# EAGLE schematic esquematico_trampa (EAGLE 9.6.2)
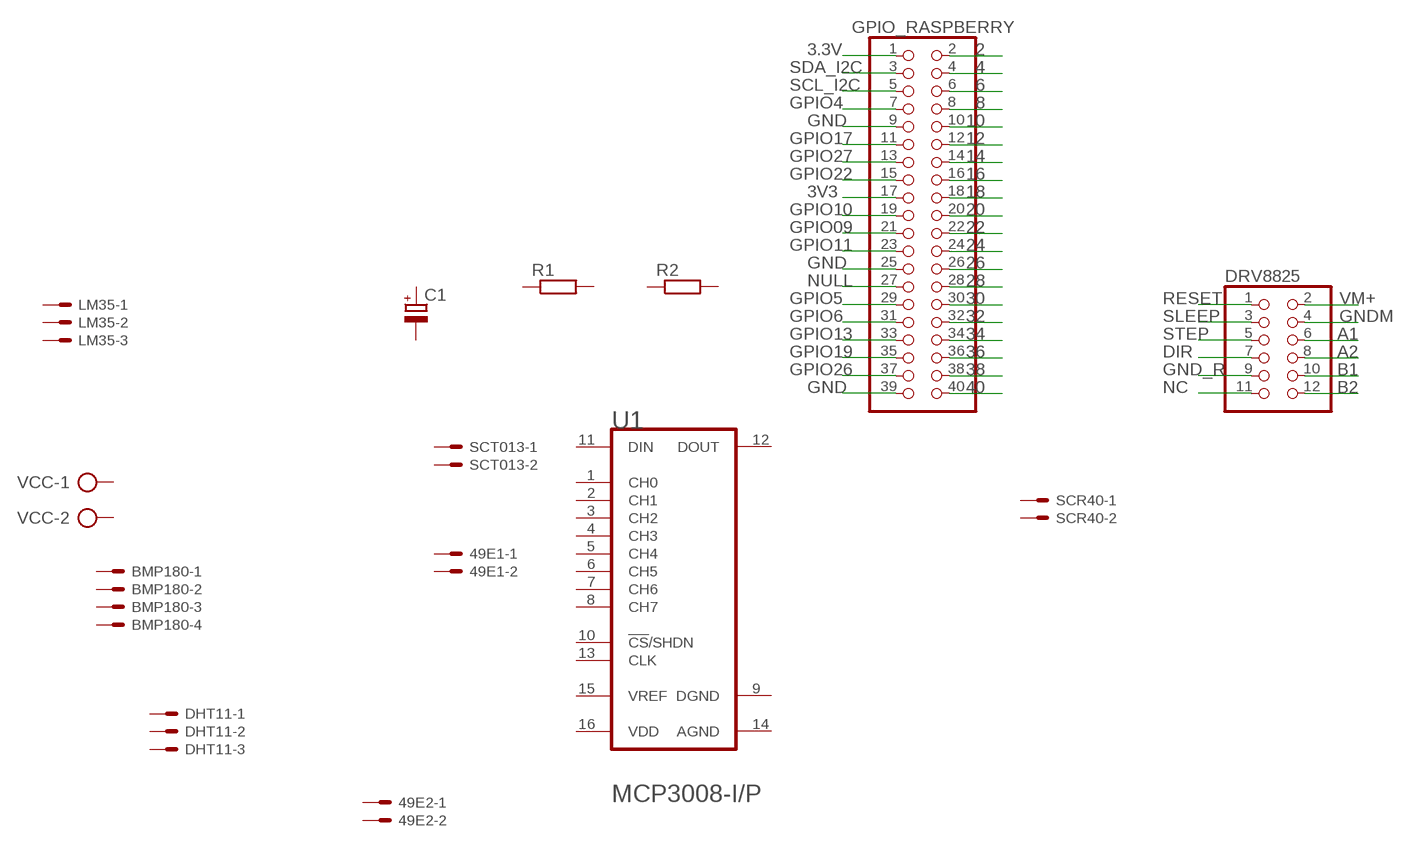
[diagram p0: schematic, sheet 1]

## Parts
49E1  22-23-2021  [22-23-2021]
49E2  22-23-2021  [22-23-2021]
BMP180  22-23-2041  [22-23-2041]
C1  CPOL-EUE5-8.5  [E5-8,5]
DHT11  22-23-2031  [22-23-2031]
DRV8825  PINHD-2X6  [2X06]
GPIO_RASPBERRY  PINHD-2X20  [2X20]
LM35  22-23-2031  [22-23-2031]
R1  R-EU_0309/12  [0309/12]
R2  R-EU_0309/12  [0309/12]
SCR40  22-23-2021  [22-23-2021]
SCT013  22-23-2021  [22-23-2021]
U1  MICROCHIP_MCP3008-I-PMICROCHIP_MCP3008-I-P_0_0  [MICROCHIP_MCP3008-I-P_0]
VCC  AK500/2-H  [AK500/2-H]

## Nets
2: GPIO_RASPBERRY.2
3.3V: GPIO_RASPBERRY.1
3V3: GPIO_RASPBERRY.17
4: GPIO_RASPBERRY.4
6: GPIO_RASPBERRY.6
8: GPIO_RASPBERRY.8
10: GPIO_RASPBERRY.10
12: GPIO_RASPBERRY.12
14: GPIO_RASPBERRY.14
16: GPIO_RASPBERRY.16
18: GPIO_RASPBERRY.18
20: GPIO_RASPBERRY.20
22: GPIO_RASPBERRY.22
24: GPIO_RASPBERRY.24
26: GPIO_RASPBERRY.26
28: GPIO_RASPBERRY.28
30: GPIO_RASPBERRY.30
32: GPIO_RASPBERRY.32
34: GPIO_RASPBERRY.34
36: GPIO_RASPBERRY.36
38: GPIO_RASPBERRY.38
40: GPIO_RASPBERRY.40
A1: DRV8825.6
A2: DRV8825.8
B1: DRV8825.10
B2: DRV8825.12
DIR: DRV8825.7
GND: GPIO_RASPBERRY.9 GPIO_RASPBERRY.25 GPIO_RASPBERRY.39
GND_R: DRV8825.9
GNDM: DRV8825.4
GPIO4: GPIO_RASPBERRY.7
GPIO5: GPIO_RASPBERRY.29
GPIO6: GPIO_RASPBERRY.31
GPIO09: GPIO_RASPBERRY.21
GPIO10: GPIO_RASPBERRY.19
GPIO11: GPIO_RASPBERRY.23
GPIO13: GPIO_RASPBERRY.33
GPIO17: GPIO_RASPBERRY.11
GPIO19: GPIO_RASPBERRY.35
GPIO22: GPIO_RASPBERRY.15
GPIO26: GPIO_RASPBERRY.37
GPIO27: GPIO_RASPBERRY.13
NC: DRV8825.11
NULL: GPIO_RASPBERRY.27
RESET: DRV8825.1
SCL_I2C: GPIO_RASPBERRY.5
SDA_I2C: GPIO_RASPBERRY.3
SLEEP: DRV8825.3
STEP: DRV8825.5
VM+: DRV8825.2
Unconnected: 49E1.1 49E1.2 49E2.1 49E2.2 BMP180.1 BMP180.2 BMP180.3 BMP180.4 C1.+ C1.- DHT11.1 DHT11.2 DHT11.3 LM35.1 LM35.2 LM35.3 R1.1 R1.2 R2.1 R2.2 SCR40.1 SCR40.2 SCT013.1 SCT013.2 U1.1(CH0) U1.2(CH1) U1.3(CH2) U1.4(CH3) U1.5(CH4) U1.6(CH5) U1.7(CH6) U1.8(CH7) U1.10(!CS!/SHDN) U1.11(DIN) U1.12(DOUT) U1.13(CLK) U1.15(VREF) VCC.1 VCC.2

## Power pins joined to a net without a drawn wire
AGND: U1.14(AGND)
DGND: U1.9(DGND)
VDD: U1.16(VDD)

## Library data of the parts
49E1 49E2 SCR40 SCT013 = con-molex:22-23-2021: .100" (2.54mm) Center Header - 2 Pin; MF: MOLEX; MPN: 22-23-2021; OC_FARNELL: 1462926; OC_NEWARK: 25C3832
BMP180 = con-molex:22-23-2041: .100" (2.54mm) Center Header - 4 Pin; MF: MOLEX; MPN: 22-23-2041; OC_FARNELL: 1462920; OC_NEWARK: 38C0355
C1 = rcl:CPOL-EU: POLARIZED CAPACITOR, European symbol; SPICEPREFIX: C
DHT11 LM35 = con-molex:22-23-2031: .100" (2.54mm) Center Header - 3 Pin; MF: MOLEX; MPN: 22-23-2031; OC_FARNELL: 1462950; OC_NEWARK: 30C0862
DRV8825 = pinhead:PINHD-2X6: PIN HEADER; SPICEPREFIX: X
GPIO_RASPBERRY = pinhead:PINHD-2X20: PIN HEADER
R1 R2 = rcl:R-EU_: RESISTOR, European symbol; SPICEPREFIX: R
U1 = P:MICROCHIP_MCP3008-I-P: CON-ADC-MCP3008-16; CIIVA_IDS: 1029167; CODE__JEDEC: MS-001-BB; COMPONENT_LINK_1_DESCRIPTION: Manufacturer URL; COMPONENT_LINK_1_URL: http://www.microchip.com/; COMPONENT_LINK_3_DESCRIPTION: Package Specification; COMPONENT_LINK_3_URL: http://www.microchip.com/stellent/groups/techpub_sg/documents/packagingspec/en012702.pdf; DATASHEET: http://ww1.microchip.com/downloads/en/DeviceDoc/21295d.pdf; DATASHEET_VERSION: revD, Dec-2008; FOOTPRINT_VARIANT_NAME_0: Manufacturer Recommended; IMPORTED: yes; IMPORTED_FROM: vault; IMPORT_TS: 1521858609; MF: Microchip; MPN: MCP3008-I/P; PACKAGE: PDIP300-P16; PACKAGE_DESCRIPTION: 16-Lead Plastic Dual In-Line (P) - 300 mil Body [PDIP]; PACKAGE_VERSION: revBB, Aug-2009; PIN_0_0_4_INSIDE_EDGE: clock; PREFIX: U; RELEASE_DATE: 1331947901; VAULT_GUID: 2915DD49-D9E5-42B8-8D13-7AC3BE91A6A7; VAULT_REVISION: 766F0992-63B6-4F6C-8EA7-A406CB97F150
VCC = con-ptr500:AK500/2-H: CONNECTOR Aug. 2004 / PTR Meßtechnik: Die Bezeichnung der Serie AK505 wurde geändert. Es handelt sich hierbei um AK500 in horizontaler Ausführung.; OC_FARNELL: unknown; OC_NEWARK: unknown